# Altium schematic sheet XBEE-BREAKOUT.SchDoc
size A4; Organization: RIT/SPEX; Address1: Rochester Institute of Technology; Address2: Rochester; Address3: New York; Address4: USA
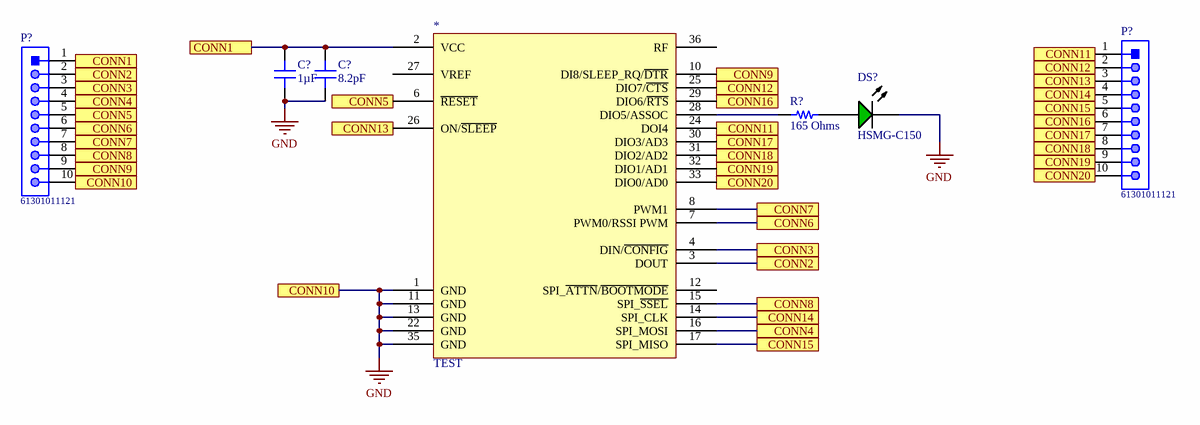
[diagram p0: XBEE-BREAKOUT.SchDoc]

## Parts
(Parts that share a designator on the sheet are numbered #1, #2 ... from top to bottom, then left to right.)
*  TEST
C?#1  1µF  [CAP 1206_3216 - 1.8MM]
C?#2  8.2pF  [CAP 0603_1608]
DS?  HSMG-C150  [AVAG-HSMX-C150_V]
P?#1  61301011121  [61301011121]
P?#2  61301011121  [61301011121]
R?  165 Ohms  [RES 0603_1608]

## Ports
CONN1, CONN2, CONN3, CONN4, CONN5, CONN6, CONN7, CONN8, CONN9, CONN10, CONN11, CONN12, CONN13, CONN14, CONN15, CONN16, CONN17, CONN18, CONN19, CONN20

## Nets
GND: *.1(GND) *.11(GND) *.13(GND) *.22(GND) *.35(GND) C?#1.1 C?#2.2 DS?.2(K) P?#2.10 ; port CONN10
CONN1: *.2(VCC) C?#1.2 C?#2.1 P?#2.1 ; port CONN1
CONN2: *.3(DOUT) P?#2.2 ; port CONN2
CONN3: *.4(DIN/~{CONFIG}) P?#2.3 ; port CONN3
CONN4: *.16(SPI_MOSI) P?#2.4 ; port CONN4
CONN5: *.6(~{RESET}) P?#2.5 ; port CONN5
CONN6: *.7(PWM0/RSSI_PWM) P?#2.6 ; port CONN6
CONN7: *.8(PWM1) P?#2.7 ; port CONN7
CONN8: *.15(SPI_~{SSEL}) P?#2.8 ; port CONN8
CONN9: *.10(DI8/SLEEP_RQ/~{DTR}) P?#2.9 ; port CONN9
CONN11: *.24(DOI4) P?#1.1 ; port CONN11
CONN12: *.25(DIO7/~{CTS}) P?#1.2 ; port CONN12
CONN13: *.26(ON/~{SLEEP}) P?#1.3 ; port CONN13
CONN14: *.14(SPI_CLK) P?#1.4 ; port CONN14
CONN15: *.17(SPI_MISO) P?#1.5 ; port CONN15
CONN16: *.29(DIO6/~{RTS}) P?#1.6 ; port CONN16
CONN17: *.30(DIO3/AD3) P?#1.7 ; port CONN17
CONN18: *.31(DIO2/AD2) P?#1.8 ; port CONN18
CONN19: *.32(DIO1/AD1) P?#1.9 ; port CONN19
CONN20: *.33(DIO0/AD0) P?#1.10 ; port CONN20
Net*_28: *.28(DIO5/ASSOC) R?.1
NetDS?_1: DS?.1(A) R?.2

Not connected (* = marked no-connect by the designer): * 12(SPI_~{ATTN}/~{BOOTMODE}) 27(VREF) 36(RF)

## Notes on the sheet
- Title
- Size:
- Date:
- A4
- Author
- Time:
- Sheet
- Revision:
- of
- RIT Space Exploration Team
- Rochester Institute of Technology
- 1 Lomb Memorial Drive
- Rochester, NY 14623
- https://spex.rit.edu
- File:

## Library data of the parts
C?#1 = C1206F105K5RACAUTO: CAP CER 1UF 50V X7R 1206; Manufacturer: KEMET; Tolerance: ±10%; Part Number: C1206F105K5RACAUTO; Value: 1µF; Applications: Automotive; Capacitance: 1µF; ComponentLink1Description: Datasheet; ComponentLink1URL: https://api.kemet.com/component-edge/download/datasheet/C1206F105K5RACAUTO.pdf; ComponentLink2Description: DigiKey Link; ComponentLink2URL: http://digikey.com/product-detail/en/kemet/C1206F105K5RACAUTO/399-7032-1-ND/3314539; Device Package: 1206 (3216 Metric); Features: Open Mode; LastUpdated: 1/21/2020 12:03:48 AM; Lifecycle Status: Active; Minimum Order: 1; Mounting Type: Surface Mount, MLCC; Operating Temperature: -55°C ~ 125°C; Package / Case: 1206 (3216 Metric); Packaging: TapeAndReel; PartId: 20008; Part Status: Active; Price: 0.22; Ratings: AEC-Q200; Series: SMD Auto X7R FO; Size / Dimension: 0.126" L x 0.063" W (3.20mm x 1.60mm); Supplier 1: DigiKey; Supplier Part Number 1: 399-7032-1-ND; Temperature Coefficient: X7R; Thickness (Max): 0.071" (1.80mm); Voltage - Rated: 50V
C?#2 = C0603C829D5GACAUTO: CAP CER 8.2PF 50V C0G/NP0 0603; Manufacturer: KEMET; Temperature Coefficient: C0G, NP0; Tolerance: ±0.5pF; Part Number: C0603C829D5GACAUTO; Value: 8.2pF; Applications: Automotive; Capacitance: 8.2pF; ComponentLink1Description: Datasheet; ComponentLink1URL: https://api.kemet.com/component-edge/download/datasheet/C0603C829D5GACAUTO.pdf; ComponentLink2Description: DigiKey Link; ComponentLink2URL: http://digikey.com/product-detail/en/kemet/C0603C829D5GACAUTO/399-15853-1-ND/7516353; Device Package: 0603 (1608 Metric); Features: Low ESL; LastUpdated: 1/21/2020 12:02:05 AM; Lifecycle Status: Active; Minimum Order: 1; Mounting Type: Surface Mount, MLCC; Operating Temperature: -55°C ~ 125°C; Package / Case: 0603 (1608 Metric); Packaging: TapeAndReel; PartId: 5364; Part Status: Active; Price: 0.06; Ratings: AEC-Q200; Series: SMD Auto C0G; Size / Dimension: 0.063" L x 0.031" W (1.60mm x 0.80mm); Supplier 1: DigiKey; Supplier Part Number 1: 399-15853-1-ND; Thickness (Max): 0.034" (0.87mm); Voltage - Rated: 50V
DS? = CMP-2000-05061-1: Chip LED, Green, 65 mW, 25 mA, -40 to 85 degC, 2-Pin SMD, RoHS, Tape and Reel; Manufacturer: Avago; Forward Voltage VF Max: 2.6V; Forward Current If Max: 20mA; Bulb Size: 1.6mmx2mm; PIV Max: 5V; Dominant Wavelength: 572nm; External Length / Height: 3.2mm; SVHC: NoSVHC(16-Jun-2014); Viewing Angle: 170deg; Peak Wavelength: 570nm; External Width: 1.6mm; No. of Pins: 2; Luminous Intensity Typ: 15mcd; Light Output Orientation: TopEmitting; LED Type: Standard; Luminous Intensity @ If Min: 4.5mcd; Voltage Vf Min: 2.2V; Lens Shape: Rectangular; External Depth: 1.1mm; Material: GaP; Opto Mounting Orientation: Top; Package Reference: HSMX-C150; Mounting Type: SMD; Datasheet Version: Mar-12; Storage Temperature Max: 85degC; Forward Current If: 20mA; Operating Temperature Min: -30degC; Operating Temperature Max: 85degC; Wavelength Typ: 572nm; Datasheet URL: https://datasheet.ciiva.com/11774/0900766b804a6539-11774272.pdf; Luminous Intensity: 15mcd; Manufacturer URL: http://www.avagotech.com/; Storage Temperature Min: -40degC; Package Description: 2-Pin Surface Mount Device, Body 3.2 x 1.6 mm; MSL: MSL2A-4weeks; LED Colour: Green; Operating Temperature Range: -30degCto+85degC; LED Mounting: SMD; Voltage Vf Typ: 2.2V; Opto Case Style: SMD; Packaging: CutTape; Forward Voltage: 2.2V; Reverse Protection Voltage: 5V
P?#1 P?#2 = CMP-1502-01082-1: THT Vertical Pin Header WR-PHD, Pitch 2.54 mm, Single Row, 10 pins; Manufacturer: Wurth Elektronik; Contact Resistance: 20mOhm; Rated Current: 3A; Pitch: 2.54mm; Gender: Male; Pin Number: 10; Working Voltage: 250VAC; Withstanding Voltage: 500VAC; Manufacturer URL: http://www.we-online.de; Operating Temperature: -40to105degC; Datasheet URL: https://katalog.we-online.de/em/datasheet/6130xx11121.pdf; Row Number: Single; Orientation: Vertical; Part Number: 61301011121; Packaging: Bag; Package Reference: 61301011121; Mounting Technology: THT; Publisher: WurthElektronik
R? = CRCW0603165RFKEA: RES SMD 165 OHM 1% 1/10W 0603; Manufacturer: Vishay Dale; Power (Watts): 0.1W, 1/10W; Temperature Coefficient: ±100ppm/°C; Part Number: CRCW0603165RFKEA; Value: 165 Ohms; ComponentLink1Description: Datasheet; ComponentLink1URL: http://www.vishay.com/docs/20035/dcrcwe3.pdf; ComponentLink2Description: DigiKey Link; ComponentLink2URL: http://digikey.com/product-detail/en/vishay-dale/CRCW0603165RFKEA/541-165HCT-ND/1179718; Composition: Thick Film; Device Package: 0603 (1608 Metric); Features: Automotive AEC-Q200; Height - Seated (Max): 0.020" (0.50mm); LastUpdated: 1/21/2020 12:18:44 AM; Lifecycle Status: Active; Minimum Order: 1; Number of Terminations: 2; Operating Temperature: -55°C ~ 155°C; Package / Case: 0603 (1608 Metric); Packaging: CutTape; PartId: 20068; Part Status: Active; Price: 0.10; Ratings: AEC-Q200; Resistance: 165 Ohms; Series: CRCW; Size / Dimension: 0.061" L x 0.033" W (1.55mm x 0.85mm); Supplier 1: DigiKey; Supplier Part Number 1: 541-165HCT-ND; Supplier Device Package: 0603; Tolerance: ±1%